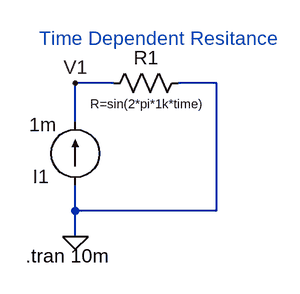
[diagram p0: schematic Time Varying Resistance.asc]
Time Varying Resistance.asc, the LTspice schematic file:
Version 4
SHEET 1 1096 680
WIRE 128 80 80 80
WIRE 256 80 208 80
WIRE 80 128 80 80
WIRE 80 240 80 208
WIRE 256 240 256 80
WIRE 256 240 80 240
WIRE 80 272 80 240
FLAG 80 272 0
FLAG 80 80 V1
SYMBOL current 80 208 R180
WINDOW 0 33 11 Left 2
WINDOW 3 24 76 Left 2
WINDOW 123 0 0 Left 0
WINDOW 39 0 0 Left 0
SYMATTR InstName I1
SYMATTR Value 1m
SYMBOL res 112 96 R270
WINDOW 0 32 56 VTop 2
WINDOW 3 0 56 VBottom 1
SYMATTR InstName R1
SYMATTR Value R=sin(2*pi*1k*time)
TEXT 18 296 Left 2 !.tran 10m
TEXT 328 24 Right 2 ;Time Dependent Resitance

The netlist it stands for:
* Time Varying Resistance.asc
I1 0 V1 1m
R1 V1 0 R=sin(2*pi*1k*time)
.tran 10m
* Time Dependent Resitance
.backanno
.end